# Altium schematic sheet Sensor_Box_Smart_IO.SchDoc: Title
size 420 x 297 mm; Author: G.Kasprowicz; CompanyName: WUT ISE; DrawnBy: G.Kasprowicz; Organization: WUT ISE; Address1: PW ISE; Address2: Nowowiejska 15/19 00-665 Warsaw; Address3: gkasprow@gmail.com; Revision: 1.0; SheetNumber: -; SheetTotal: -; ModifiedBy: -; CheckedDate: -; Title2: Title2; DivGrp: WUT ISE; Designer: G.Kasprowicz; ModifiedDate: -; ProjectName: Sensor Box
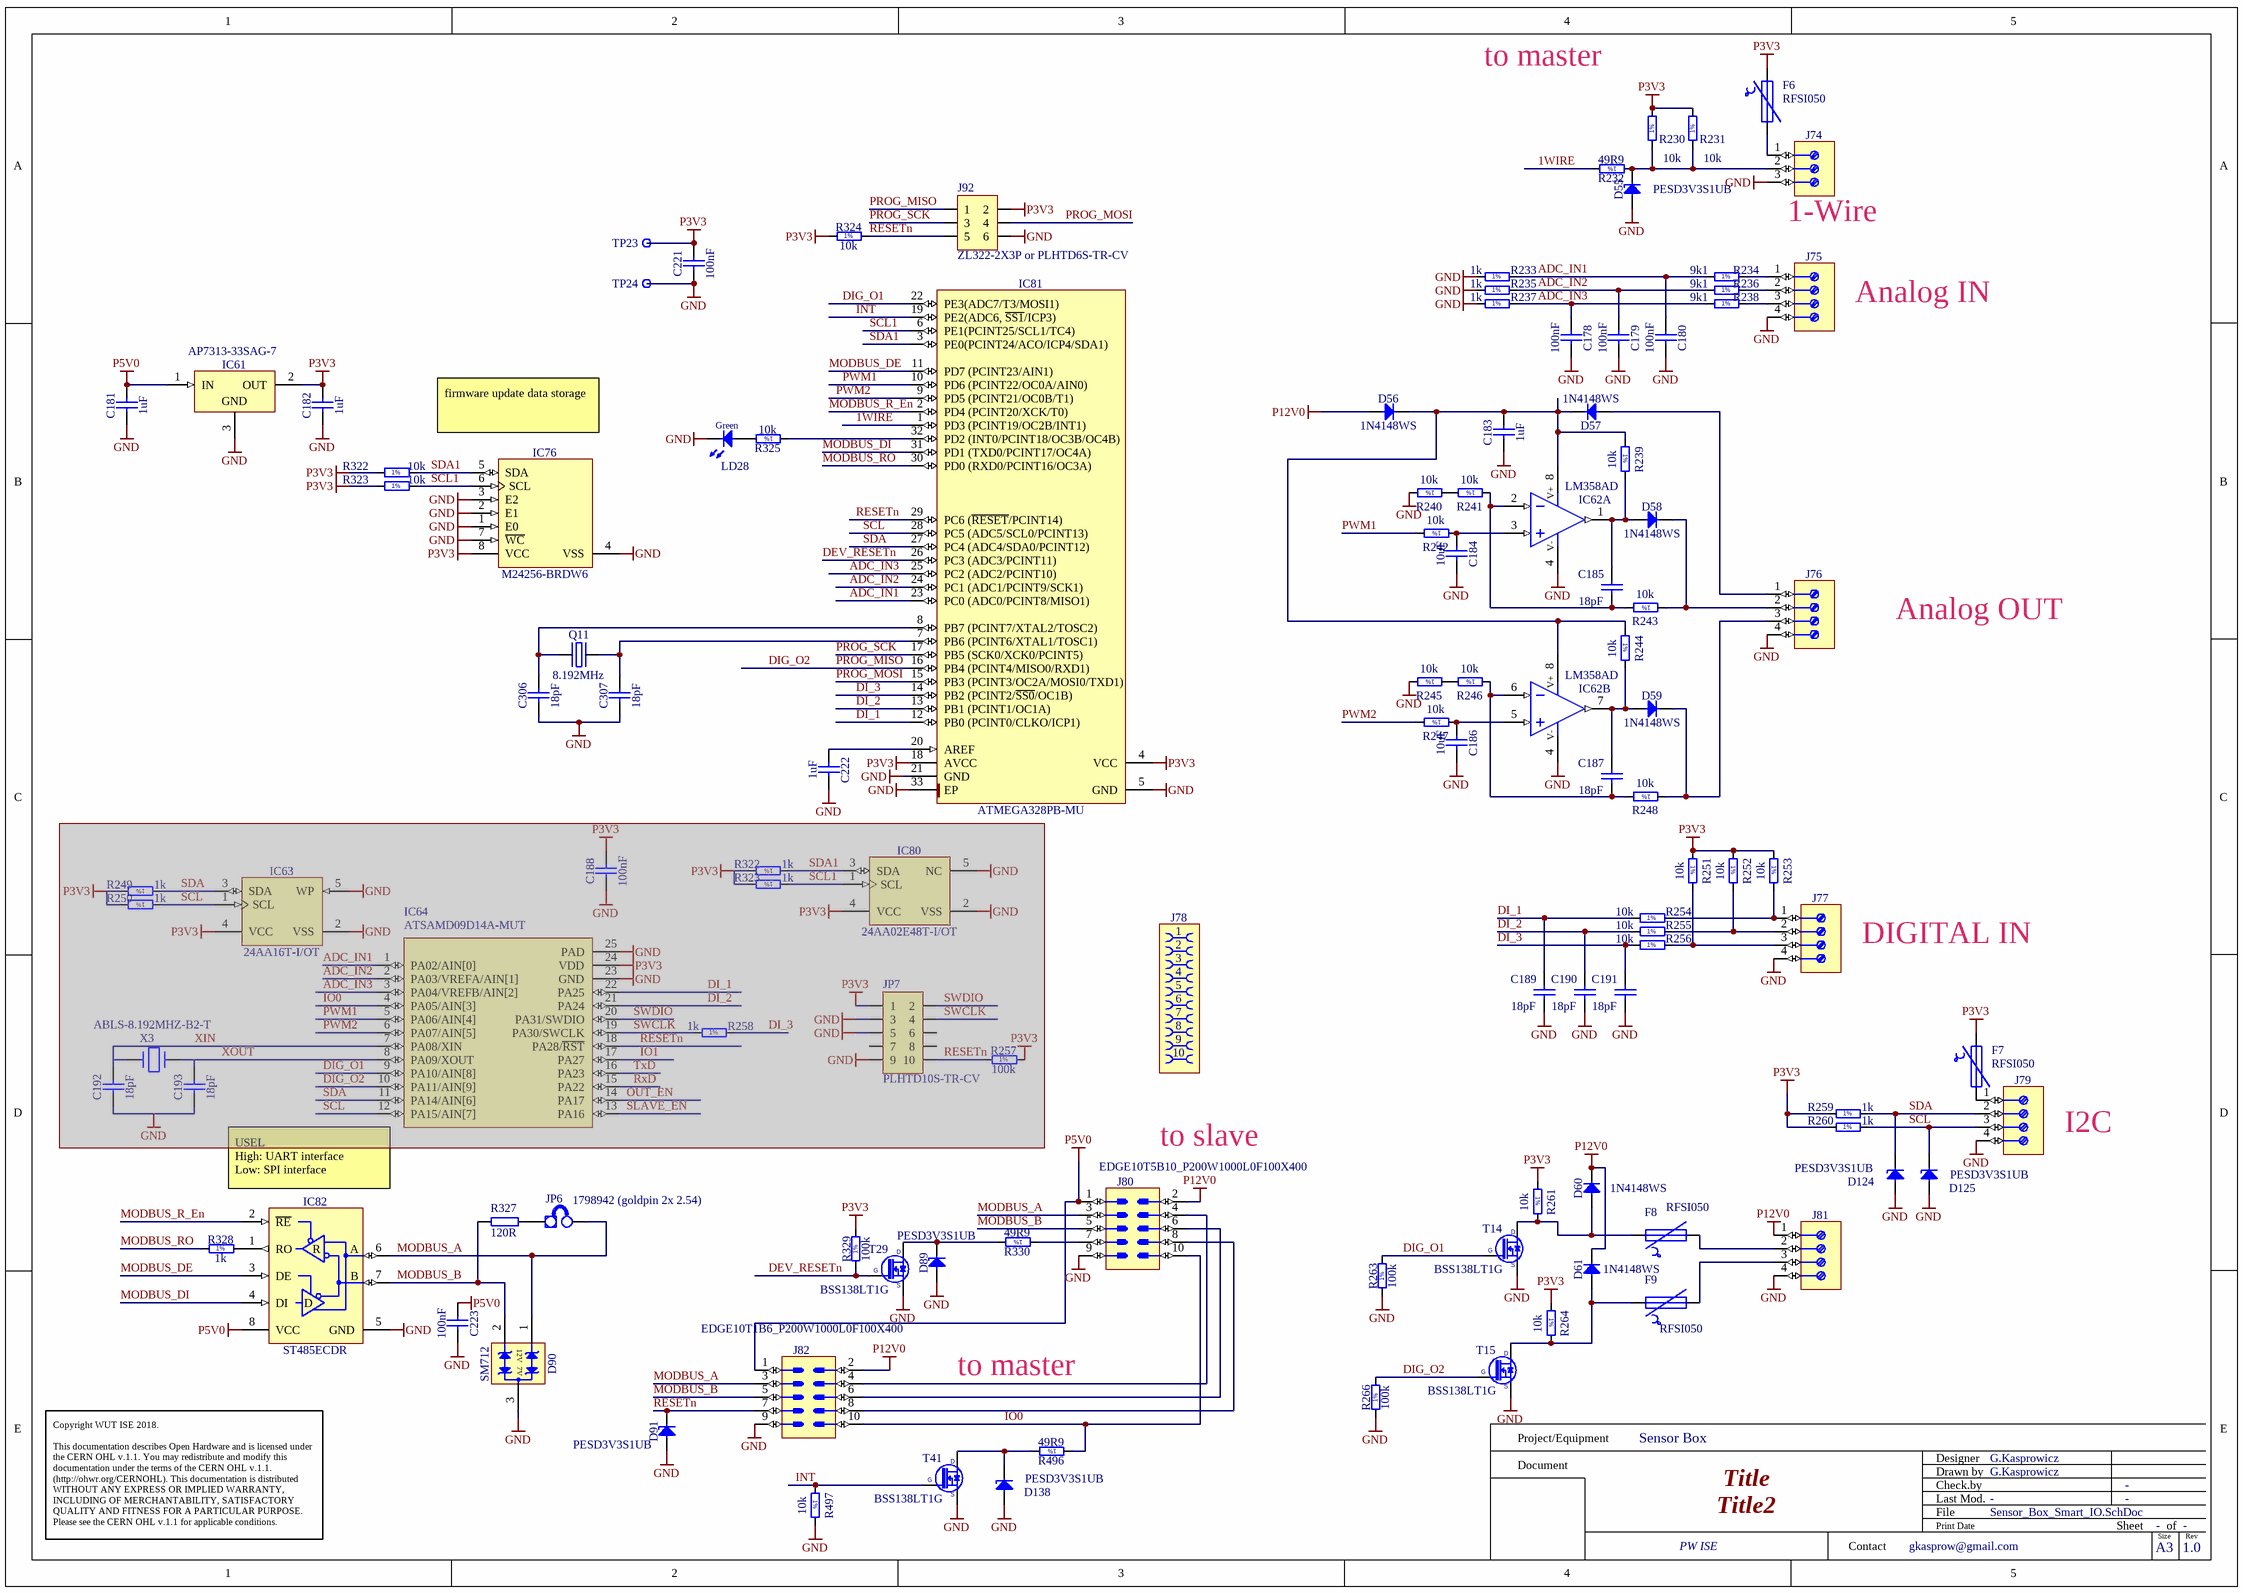
[diagram p0: Sensor_Box_Smart_IO.SchDoc]

## Parts
(Parts that share a designator on the sheet are numbered #1, #2 ... from top to bottom, then left to right.)
C178  100nF  [CAPC1005X55N]
C179  100nF  [CAPC1005X55N]
C180  100nF  [CAPC1005X55N]
C181  1uF  [CAPC1005X55N]
C182  1uF  [CAPC1005X55N]
C183  1uF  [CAPC1005X55N]
C184  10uF  [CAPC2012X135N]
C185  18pF  [CAPC1005X55N]
C186  10uF  [CAPC2012X135N]
C187  18pF  [CAPC1005X55N]
C188  100nF  [CAPC1005X55N]  (masked out: inside a compile mask, not in the netlist)
C189  18pF  [CAPC1005X55N]
C190  18pF  [CAPC1005X55N]
C191  18pF  [CAPC1005X55N]
C192  18pF  [CAPC1005X55N]  (masked out: inside a compile mask, not in the netlist)
C193  18pF  [CAPC1005X55N]  (masked out: inside a compile mask, not in the netlist)
C221  100nF  [CAPC1005X55N]
C222  1uF  [CAPC1005X55N]
C223  100nF  [CAPC1005X55N]
C306  18pF  [CAPC1005X55N]
C307  18pF  [CAPC1005X55N]
D55  PESD3V3S1UB  [SODFL1608X65N]
D56  1N4148WS  [SODFL2512X100N]
D57  1N4148WS  [SODFL2512X100N]
D58  1N4148WS  [SODFL2512X100N]
D59  1N4148WS  [SODFL2512X100N]
D60  1N4148WS  [SODFL2512X100N]
D61  1N4148WS  [SODFL2512X100N]
D89  PESD3V3S1UB  [SODFL1608X65N]
D90  SM712  [SOT95P237X112-3N]
D91  PESD3V3S1UB  [SODFL1608X65N]
D124  PESD3V3S1UB  [SODFL1608X65N]
D125  PESD3V3S1UB  [SODFL1608X65N]
D138  PESD3V3S1UB  [SODFL1608X65N]
F6  RFSI050  [0805R]
F7  RFSI050  [0805R]
F8  RFSI050  [0805R]
F9  RFSI050  [0805R]
IC61  AP7313-33SAG-7  [SOT95P240X130-3N]
IC62  LM358AD  [SOIC127P600X175-8N]  (parts A,B of 2)
IC63  24AA16T-I/OT  [SOT95P280X145-5N]  (masked out: inside a compile mask, not in the netlist)
IC64  ATSAMD09D14A-MUT  [QFN50P400X400X80_HS-25N]  (masked out: inside a compile mask, not in the netlist)
IC76  M24256-BRDW6  [SOP65P640X120-8N]
IC80  24AA02E48T-I/OT  [SOT95P280X145-5N]  (masked out: inside a compile mask, not in the netlist)
IC81  ATMEGA328PB-MU  [QFN50P500X500X100-33N-S325]
IC82  ST485ECDR  [SOIC127P600X175-8N]
J74  (no value)  [PHOENIX_1725669]
J75  (no value)  [PHOENIX_1725672]
J76  (no value)  [PHOENIX_1725672]
J77  (no value)  [PHOENIX_1725672]
J78  (no value)  [AVX_00 9159 010 061 916]
J79  (no value)  [PHOENIX_1725672]
J80  (no value)  [EDGE10T5B10_P200W1000L0F100X400]
J81  (no value)  [PHOENIX_1725672]
J82  (no value)  [EDGE10T1B6_P200W1000L0F100X400]
J92  ZL322-2X3P or PLHTD6S-TR-CV  [ZL322-2X3P]
JP6  1798942 (goldpin 2x 2.54)  [jump]
JP7  PLHTD10S-TR-CV  [PLHTD10S-TR-CV]  (masked out: inside a compile mask, not in the netlist)
LD28  Green  [LED_KINGBRIGHT_KPH-1608CGCK]
Q11  8.192MHz  [XTAL_ABRACON_ABLS]
R230  10k  [RESC1005X40N]
R231  10k  [RESC1005X40N]
R232  49R9  [RESC1005X40N]
R233  1k  [RESC1005X40N]
R234  9k1  [RESC1608X55N]
R235  1k  [RESC1005X40N]
R236  9k1  [RESC1608X55N]
R237  1k  [RESC1005X40N]
R238  9k1  [RESC1608X55N]
R239  10k  [RESC1005X40N]
R240  10k  [RESC1005X40N]
R241  10k  [RESC1005X40N]
R242  10k  [RESC1005X40N]
R243  10k  [RESC1005X40N]
R244  10k  [RESC1005X40N]
R245  10k  [RESC1005X40N]
R246  10k  [RESC1005X40N]
R247  10k  [RESC1005X40N]
R248  10k  [RESC1005X40N]
R249  1k  [RESC1005X40N]  (masked out: inside a compile mask, not in the netlist)
R250  1k  [RESC1005X40N]  (masked out: inside a compile mask, not in the netlist)
R251  10k  [RESC1005X40N]
R252  10k  [RESC1005X40N]
R253  10k  [RESC1005X40N]
R254  10k  [RESC1005X40N]
R255  10k  [RESC1005X40N]
R256  10k  [RESC1005X40N]
R257  100k  [RESC1005X40N]  (masked out: inside a compile mask, not in the netlist)
R258  1k  [RESC1005X40N]  (masked out: inside a compile mask, not in the netlist)
R259  1k  [RESC1005X40N]
R260  1k  [RESC1005X40N]
R261  10k  [RESC1005X40N]
R263  100k  [RESC1005X40N]
R264  10k  [RESC1005X40N]
R266  100k  [RESC1005X40N]
R322#1  10k  [RESC1005X40N]
R322#2  1k  [RESC1005X40N]  (masked out: inside a compile mask, not in the netlist)
R323#1  10k  [RESC1005X40N]
R323#2  1k  [RESC1005X40N]  (masked out: inside a compile mask, not in the netlist)
R324  10k  [RESC1005X40N]
R325  10k  [RESC1005X40N]
R327  120R  [1206R]
R328  1k  [RESC1005X40N]
R329  100k  [RESC1005X40N]
R330  49R9  [RESC1005X40N]
R496  49R9  [RESC1005X40N]
R497  10k  [RESC1005X40N]
T14  BSS138LT1G  [SOT95P240X110-3N]
T15  BSS138LT1G  [SOT95P240X110-3N]
T29  BSS138LT1G  [SOT95P240X110-3N]
T41  BSS138LT1G  [SOT95P240X110-3N]
TP23  Test Point  [TPS127]  (value not drawn)
TP24  Test Point  [TPS127]  (value not drawn)
X3  ABLS-8.192MHZ-B2-T  [HC-49SM]  (masked out: inside a compile mask, not in the netlist)

## Nets
GND: C178.2 C179.2 C180.2 C181.1 C182.1 C183.1 C184.2 C186.2 C189.2 C190.2 C191.2 C221.1 C222.2 C223.2 C306.1 C307.1 D55.2(A) D89.2(A) D90.3(GND) D91.2(A) D124.2(A) D125.2(A) D138.2(A) IC61.3(GND) IC62.4(V-) IC76.1(E0) IC76.2(E1) IC76.3(E2) IC76.4(VSS) IC76.7(~{WC}) IC81.5(GND) IC81.21(GND) IC81.33(EP) IC82.5(GND) J74.3 J75.4 J76.4 J77.4 J79.4 J80.9 J81.4 J82.9 J92.6 LD28.1(C) R233.1 R235.1 R237.1 R240.2 R245.2 R263.1 R266.1 R497.2 T14.2(S) T15.2(S) T29.2(S) T41.2(S) TP24.1
P3V3: C182.2 C221.2 F6.2 F7.2 IC61.2(OUT) IC76.8(VCC) IC81.4(VCC) IC81.18(AVCC) J92.2 R230.2 R231.2 R251.1 R252.1 R253.1 R259.1 R260.1 R261.1 R264.1 R322#1.1 R323#1.1 R324.1 R329.2 TP23.1
P5V0: C181.2 C223.1 IC61.1(IN) IC82.8(VCC) J80.1 J82.1
P12V0: D56.2(A) D60.1(C) D61.1(C) J80.2 J81.1 J82.2
1WIRE: IC81.1(PD3_(PCINT19/OC2B/INT1)) R232.2
ADC_IN1: C180.1 IC81.23(PC0_(ADC0/PCINT8/MISO1)) R233.2 R234.1
ADC_IN2: C179.1 IC81.24(PC1_(ADC1/PCINT9/SCK1)) R235.2 R236.1
ADC_IN3: C178.1 IC81.25(PC2_(ADC2/PCINT10)) R237.2 R238.1
DEV_RESETn: IC81.26(PC3_(ADC3/PCINT11)) R329.1 T29.1(G)
DI_1: C189.1 IC81.12(PB0_(PCINT0/CLKO/ICP1)) R254.1
DI_2: C190.1 IC81.13(PB1_(PCINT1/OC1A)) R255.1
DI_3: C191.1 IC81.14(PB2_(PCINT2/~{SS0}/OC1B)) R256.1
DIG_O1: IC81.22(PE3(ADC7/T3/MOSI1)) R263.2 T14.1(G)
DIG_O2: IC81.16(PB4_(PCINT4/MISO0/RXD1)) J92.1 R266.2 T15.1(G)  [also labelled PROG_MISO]
INT: IC81.19(PE2(ADC6,_~{SS1}/ICP3)) R497.1 T41.1(G)
IO0: J80.10 J82.10 R496.1
MODBUS_A: D90.1(I/O1) IC82.6(A) J80.3 J82.3 JP6.2(E2)
MODBUS_B: D90.2(I/O2) IC82.7(B) J80.5 J82.5 R327.1
MODBUS_DE: IC81.11(PD7_(PCINT23/AIN1)) IC82.3(DE)
MODBUS_DI: IC81.31(PD1_(TXD0/PCINT17/OC4A)) IC82.4(DI)
MODBUS_R_En: IC81.2(PD4_(PCINT20/XCK/T0)) IC82.2(~{RE})
MODBUS_RO: IC81.30(PD0_(RXD0/PCINT16/OC3A)) R328.1
PROG_MOSI: IC81.15(PB3_(PCINT3/OC2A/MOSI0/TXD1)) J92.4
PROG_SCK: IC81.17(PB5_(SCK0/XCK0/PCINT5)) J92.3
PWM1: IC81.10(PD6_(PCINT22/OC0A/AIN0)) R242.2
PWM2: IC81.9(PD5_(PCINT21/OC0B/T1)) R247.2
RESETn: D91.1(C) IC81.29(PC6_(~{RESET}/PCINT14)) J82.7 J92.5 R324.2
SCL: D125.1(C) IC81.28(PC5_(ADC5/SCL0/PCINT13)) J79.3 R260.2
SCL1: IC76.6(SCL) IC81.6(PE1(PCINT25/SCL1/TC4)) R323#1.2
SDA: D124.1(C) IC81.27(PC4_(ADC4/SDA0/PCINT12)) J79.2 R259.2
SDA1: IC76.5(SDA) IC81.3(PE0(PCINT24/ACO/ICP4/SDA1)) R322#1.2
NetC183_2: C183.2 D56.1(C) D57.1(C) IC62.8(V+) R239.1 R244.1
NetC184_1: C184.1 IC62.3(IN+) R242.1
NetC185_1: C185.1 D58.2(A) IC62.1(OUT) R239.2
NetC185_2: C185.2 IC62.2(IN-) R241.1 R243.2
NetC186_1: C186.1 IC62.5(IN+) R247.1
NetC187_1: C187.1 D59.2(A) IC62.7(OUT) R244.2
NetC187_2: C187.2 IC62.6(IN-) R246.1 R248.2
NetC222_1: C222.1 IC81.20(AREF)
NetC306_2: C306.2 IC81.8(PB7_(PCINT7/XTAL2/TOSC2)) Q11.1(OSC1)
NetC307_2: C307.2 IC81.7(PB6_(PCINT6/XTAL1/TOSC1)) Q11.2(OSC2)
NetD55_1: D55.1(C) J74.2 R230.1 R231.1 R232.1
NetD57_2: D57.2(A) J76.1
NetD58_1: D58.1(C) J76.2 R243.1
NetD59_1: D59.1(C) J76.3 R248.1
NetD60_2: D60.2(A) F8.2 R261.2 T14.3(D)
NetD61_2: D61.2(A) F9.2 R264.2 T15.3(D)
NetD89_1: D89.1(C) R330.2 T29.3(D)
NetD138_1: D138.1(C) R496.2 T41.3(D)
NetF6_1: F6.1 J74.1
NetF7_1: F7.1 J79.1
NetF8_1: F8.1 J81.2
NetF9_1: F9.1 J81.3
NetIC81_32: IC81.32(PD2_(INT0/PCINT18/OC3B/OC4B)) R325.1
NetIC82_1: IC82.1(RO) R328.2
NetJ75_1: J75.1 R234.2
NetJ75_2: J75.2 R236.2
NetJ75_3: J75.3 R238.2
NetJ77_1: J77.1 R253.2 R254.2
NetJ77_2: J77.2 R252.2 R255.2
NetJ77_3: J77.3 R251.2 R256.2
NetJ80_4: J80.4 J82.4
NetJ80_6: J80.6 J82.6
NetJ80_7: J80.7 R330.1
NetJ80_8: J80.8 J82.8
NetJP6_1: JP6.1(E1) R327.2
NetLD28_2: LD28.2(A) R325.2
NetR240_1: R240.1 R241.2
NetR245_1: R245.1 R246.2

## Notes on the sheet
- (near R230) to master
- (near J74) 1-Wire
- Analog IN
- firmware update data storage
- Analog OUT
- DIGITAL IN
- I2C
- (near IC64) USEL
  High: UART interface
  Low: SPI interface
- (near J80) to slave
- to master
- Project/Equipment
- Document
- Designer
- Drawn by
- Check.by
- Copyright WUT ISE 2018.
  This documentation describes Open Hardware and is licensed under the CERN OHL v.1.1. You may redistribute and modify this documentation under the terms of the CERN OHL v.1.1. (http://ohwr.org/CERNOHL). This documentation is distributed WITHOUT ANY EXPRESS OR IMPLIED WARRANTY, INCLUDING OF MERCHANTABILITY, SATISFACTORY QUALITY AND FITNESS FOR A PARTICULAR PURPOSE. Please see the CERN OHL v.1.1 for applicable conditions.
- Contact
- File
- Last Mod.
- Print Date
- Sheet
- Size
- A3
- of
- Rev
- (in symbol R0402_1K_1%_0.0625W_100PPM) 1%
- (in symbol R0402_10K_1%_0.0625W_100PPM) 1%
- (in symbol R0402_49R9_1%_0.0625W_100PPM) 1%
- (in symbol R0402_100K_1%_0.0625W_100PPM) 1%
- (in symbol R0603_9K1_1%_0.1W_100PPM) 1%
- (in symbol SM712) 12V; 7V
- (in symbol ST485ECDR) R; D

## Library data of the parts
C178-C180 C223 = CC0402_100NF_16V_10%_X7R: Non-polarised capacitor; Part Description: SMD Multilayer Chip Ceramic Capacitor; Manufacturer: GENERIC; Manufacturer1 Part Number: GRM155R71C104KA88D; Voltage: 16V; TC: X7R; Tolerance: ±10%; Part Number: CC0402_100NF_16V_10%_X7R; Component Kind: Standard; Component Type: Standard; Pin Count: 2; Value: 100nF; Status: Not Recommended; Manufacturer Part Number: CC0402_100NF_16V_10%_X7R; Case: 0402; Mounted: Yes; Socket: No; SMD: Yes; Manufacturer1 Example: MURATA; Manufacturer1 ComponentHeight: 0.55mm; HelpURL: \\cern.ch\dfs\Applications\Altium\Datasheets\CC0402_X7R_MURATA_GRM.pdf; Author: CERN DEM JLC; CreateDate: 05.12.2013; LatestRevisionDate: 03.12.2007; Sense: No
C181-C183 C222 = CC0402_1UF_16V_10%_X5R: Non-polarised capacitor; Part Description: SMD Multilayer Chip Ceramic Capacitor; Manufacturer: GENERIC; Manufacturer1 Part Number: C1005X5R1C105KT; Voltage: 16V; TC: X5R; Tolerance: ±10%; Part Number: CC0402_1UF_16V_10%_X5R; Component Kind: Standard; Component Type: Standard; Pin Count: 2; Value: 1uF; Status: Preferred; Manufacturer Part Number: CC0402_1UF_16V_10%_X5R; Case: 0402; Mounted: Yes; Socket: No; SMD: Yes; Sense: No; Manufacturer1 Example: TDK; Manufacturer1 ComponentHeight: 0.55mm; HelpURL: \\cern.ch\dfs\Applications\Altium\Datasheets\CC0402_X5R_TDK_C.pdf; Author: CERN DEM JLC; CreateDate: 25.10.2012; LatestRevisionDate: 25.10.2012
C184 C186 = CC0805_10UF_16V_10%_X5R: Non-polarised capacitor; Part Description: SMD Multilayer Chip Ceramic Capacitor; Manufacturer: GENERIC; Manufacturer1 Part Number: C0805C106K4PAC; Voltage: 16V; TC: X5R; Tolerance: ±10%; Part Number: CC0805_10UF_16V_10%_X5R; Component Kind: Standard; Component Type: Standard; Pin Count: 2; Value: 10uF; Status: Preferred; Manufacturer Part Number: CC0805_10UF_16V_10%_X5R; Case: 0805; Mounted: Yes; Socket: No; SMD: Yes; Manufacturer1 Example: KEMET; Manufacturer1 ComponentHeight: 1.4mm; HelpURL: \\cern.ch\dfs\Applications\Altium\Datasheets\CC1206_X5R_KEMET.pdf; Author: CERN DEM JLC; CreateDate: 03.12.2007; LatestRevisionDate: 03.12.2007; Sense: No
C185 C187 C189-C193 C306 C307 = CC0402_18PF_50V_5%_C0G: Non-polarised capacitor; Part Description: SMD Multilayer Chip Ceramic Capacitor; Manufacturer: GENERIC; Manufacturer1 Part Number: C0402C180J5GACTU; Voltage: 50V; TC: C0G/NP0; Tolerance: ±5%; Part Number: CC0402_18PF_50V_5%_C0G; Component Kind: Standard; Component Type: Standard; Pin Count: 2; Value: 18pF; Status: Preferred; Manufacturer Part Number: CC0402_18PF_50V_5%_C0G; Case: 0402; Mounted: Yes; Socket: No; SMD: Yes; Sense: No; Manufacturer1 Example: KEMET; Manufacturer1 ComponentHeight: 0.55mm; HelpURL: \\cern.ch\dfs\Applications\Altium\Datasheets\CC0805_C0G_KEMET_(Commercial Grade).pdf; Author: CERN DEM JLC; CreateDate: 04.10.2016; LatestRevisionDate: 04.10.2016
C188 C221 = CC0402_100NF_16V_10%_X5R: Non-polarised capacitor; Part Description: SMD Multilayer Chip Ceramic Capacitor; Manufacturer: GENERIC; Manufacturer1 Part Number: GRM155R61C104KA88D; Voltage: 16V; TC: X5R; Tolerance: ±10%; Part Number: CC0402_100NF_16V_10%_X5R; Component Kind: Standard; Component Type: Standard; Pin Count: 2; Value: 100nF; Status: None; Manufacturer Part Number: CC0402_100NF_16V_10%_X5R; Case: 0402; Mounted: Yes; Socket: No; SMD: Yes; Sense: No; Manufacturer1 Example: MURATA; Manufacturer1 ComponentHeight: 0.55mm; HelpURL: \\cern.ch\dfs\Applications\Altium\Datasheets\CC0402_X5R_MURATA_GRM.pdf; Author: CERN DEM JLC; CreateDate: 10.12.2013; LatestRevisionDate: 10.12.2013
D55 D89 D91 D124 D125 D138 = PESD3V3S1UB: ESD protection diode; Part Description: ESD protection diode (23kV); Manufacturer: NXP SEMICONDUCTORS; Voltage: 3V3; Power: 330W; PressFit: No; Bonding: No; Part Number: PESD3V3S1UB; Component Kind: Standard; Component Type: Standard; Device: PESD3V3S1UB; PackageDescription: Ultra Small Outline Diode Flat Lead (SOD-523), Body; 1.2mm L X 0.8mm W X 0.65mm H, IPC Medium Density; Manufacturer Part Number: PESD3V3S1UB; Pin Count: 2; Case: SOD523; Mounted: Yes; Socket: No; SMD: Yes; Sense: No; ComponentHeight: 0.65mm; HelpURL: \\cern.ch\dfs\Applications\Altium\Datasheets\PESD3V3S1UB.pdf; Author: CERN DEM JLC; CreateDate: 29.11.2012; LatestRevisionDate: 29.11.2012
D56-D61 = 1N4148WS: Diode; Part Description: Small Signal Diodes; Manufacturer: FAIRCHILD SEMICONDUCTOR; Voltage: 75V; Power: 150mA; PressFit: No; Bonding: No; Part Number: 1N4148WS; Component Kind: Standard; Component Type: Standard; Device: 1N4148WS; PackageDescription: SODFL Diode; 1.70mm W X 1.25mm L X 1.00mm H body, IPC Medium Density; Manufacturer Part Number: 1N4148WS; Pin Count: 2; Case: SOD-323F; Mounted: Yes; Socket: No; SMD: Yes; Sense: No; ComponentHeight: 1mm; HelpURL: \\cern.ch\dfs\Applications\Altium\Datasheets\1N4148WS.pdf; Author: CERN DEM JLC; CreateDate: 12.05.2011; LatestRevisionDate: 12.05.2011
D90 = SM712: Asymmetrical TVS Diode for Extended Common-Mode RS-485; Manufacturer: SEMTECH; Voltage: 12V/-7V; Power: 400W; PressFit: No; Bonding: No; Part Number: SM712; Component Kind: Standard; Component Type: Standard; Device: SM712; PackageDescription: SOT, 0.95mm, pitch; 3 pin,1.30mm W X 2.92mm L X 1.12mm H body, IPC Medium Density; Status: Obsolete; Part Description: Asymmetrical TVS Diode for Extended Common-Mode RS-485; Manufacturer Part Number: SM712; Pin Count: 3; Case: SOT-23; Mounted: Yes; Socket: No; SMD: Yes; Sense: No; ComponentHeight: 1.12mm; HelpURL: \\cern.ch\dfs\Applications\Altium\Datasheets\SM712.pdf; Author: CERN DEM JLC; CreateDate: 23.04.2012; LatestRevisionDate: 23.04.2012
F6-F9 = F_PTC_0.05A: 50mA polymer FUSE
IC61 = AP7313-33SAG-7: 3-Terminal Regulator 1=IN 2=OUT 3=GND; Part Description: 3.3V, 150mA Low Quiescent Current, Fast Transient Low Dropout Linear Regulator; Manufacturer: DIODES INCORPORATED; PressFit: No; Bonding: No; Part Number: AP7313-33SAG-7; Component Kind: Standard; Component Type: Standard; Device: AP7313-33SAG-7; PackageDescription: SOT23 3-Leads, Pitch 0.95mm - Body 1.3x2.9mm, IPC Medium Density; Manufacturer Part Number: AP7313-33SAG-7; Pin Count: 3; Case: SOT23; Mounted: Yes; Socket: No; SMD: Yes; Sense: No; ComponentHeight: 1.35mm; HelpURL: \\cern.ch\dfs\Applications\Altium\Datasheets\AP7313-33SAG-7.pdf; Author: CERN DEM JLC; CreateDate: 20.03.2018; LatestRevisionDate: 20.03.2018
IC62 = LM358AD: Dual Operational Amplifier; Manufacturer: TEXAS INSTRUMENTS; PressFit: No; Bonding: No; Part Number: LM358AD; Component Kind: Standard; Component Type: Standard; Device: LM358AD; PackageDescription: SOIC 8, Pitch 1.27mm - Body 4x5mm, IPC Medium Density; Part Description: Dual Operational Amplifier; Manufacturer Part Number: LM358AD; Pin Count: 8; Case: SOIC8; Mounted: Yes; Socket: No; SMD: Yes; Sense: No; ComponentHeight: 1.75mm; Author: CERN DEM JLC; HelpURL: \\cern.ch\dfs\Applications\Altium\Datasheets\LM358AD.pdf; CreateDate: 02.12.2008; LatestRevisionDate: 13.04.2010
IC63 = MEM_24AA16T_SOT23: 1.7V-5.5V, 2K I2C Serial EEPROM With EUI-48 Node Identity; Part Description: 1.7V-5.5V, 16K I2C Serial EEPROM; Manufacturer: MICROCHIP TECHNOLOGY; PressFit: No; Bonding: No; Part Number: 24AA16T-I/OT; Component Kind: Standard; Component Type: Standard; Device: 24AA16T-I/OT; PackageDescription: SOT, 0.95mm pitch; 5 pin, 1.60mm W X 2.90mm L X 1.45mm H body, IPC Medium Density; Manufacturer Part Number: 24AA16T-I/OT; Pin Count: 5; Case: SOT23-5; Mounted: Yes; Socket: No; SMD: Yes; Sense: No; ComponentHeight: 1.45mm; HelpURL: \\cern.ch\dfs\Applications\Altium\Datasheets\24AA02E48T-I-OT.pdf; Author: GK; CreateDate: 31.03.2016; LatestRevisionDate: 31.03.2016
IC64 = UPC_ATSAMD09D: 32-bit ARM®-based Cortex®-M4 core Microcontroller, 1.62V to 3.6V, 120MHz, 256KB Flash, 64KB of SRAM, 48 QFP, Industrial Grade (-40°C to 85°C); Part Description: ATSAMD09D14A-MUT  SMART SAMD09, SMART ARM based Microcontrollers, 32 bity, 48 MHz, 16 KB, 4 KB; Manufacturer: Microchip; PressFit: No; Bonding: No; Part Number: ATSAMD09D14A-MUT; Component Kind: Standard; Component Type: Standard; Device: ATSAMD09D14A-MUT; PackageDescription: QFN, 24-Leads, Body 4.00x4.00mm, Pitch 0.50mm, Thermal Pad 2.60x2.60mm, IPC Medium Density; Manufacturer Part Number: ATSAMD09D14A-MUT; Pin Count: 24; Case: QFN24; Mounted: Yes; Socket: No; SMD: Yes; Sense: No; ComponentHeight: 1.6mm; HelpURL: \\cern.ch\dfs\Applications\Altium\Datasheets\ATSAM4S4AA-AU.pdf; Author: GK; CreateDate: 16.12.2017; LatestRevisionDate: 16.12.2017
IC76 = MEM_M24256-BRDW6P: 256-Kbit Serial I²C Bus EEPROM; Manufacturer: ST MICROELECTRONICS; PressFit: No; Bonding: No; Part Number: M24256-BRDW6P; Component Kind: Standard; Component Type: Standard; Device: M24256-BRDW6; PackageDescription: SOP, 0.65mm pitch; 8 pin, 4.40mm W X 3.00mm L X 1.20mm H body, IPC Medium Density; Part Description: 256-Kbit Serial I²C Bus EEPROM; Manufacturer Part Number: M24256-BRDW6; Pin Count: 8; Case: TSSOP8; Mounted: Yes; Socket: No; SMD: Yes; Sense: No; ComponentHeight: 1.2mm; HelpURL: \\cern.ch\dfs\Applications\Altium\Datasheets\M24256-BRDW6P.pdf; Author: CERN DEM MR; CreateDate: 17.03.2016; LatestRevisionDate: 17.03.2016
IC80 = 24AA02E48T-I/OT: 1.7V-5.5V, 2K I2C Serial EEPROM With EUI-48 Node Identity; Manufacturer: MICROCHIP TECHNOLOGY; PressFit: No; Bonding: No; Part Number: 24AA02E48T-I/OT; Component Kind: Standard; Component Type: Standard; Device: 24AA02E48T-I/OT; PackageDescription: SOT, 0.95mm pitch; 5 pin, 1.60mm W X 2.90mm L X 1.45mm H body, IPC Medium Density; Part Description: 1.7V-5.5V, 2K I2C Serial EEPROM With EUI-48 Node Identity; Manufacturer Part Number: 24AA02E48T-I/OT; Pin Count: 5; Case: SOT23-5; Mounted: Yes; Socket: No; SMD: Yes; Sense: No; ComponentHeight: 1.45mm; HelpURL: \\cern.ch\dfs\Applications\Altium\Datasheets\24AA02E48T-I-OT.pdf; Author: CERN DEM MR; CreateDate: 31.03.2016; LatestRevisionDate: 31.03.2016
IC81 = UPC_ATMEGA328PB-MU: 8-bit AVR 20MHz Microcontroller With 32K Bytes In-System  Programmable  Flash; Part Description: 8-bit AVR Microcontroller, 32KB Flash, 1KB EEPROM, 2KB SRAM, 32-pin MLF, Industrial Grade (-40°C to 85°C); Manufacturer: ATMEL; PressFit: No; Bonding: No; Part Number: ATMEGA328PB-MU; Component Kind: Standard; Component Type: Standard; Device: ATMEGA328PB-MU; PackageDescription: QFN, (MO-220-VHHD-2) 0.50mm pitch,square; 8 pin X 8 pin, 5mm X 5mm X 1.00mm H body (w/thermal tab 3.25 X 3.25mm),  IPC Medium Density; Manufacturer Part Number: ATMEGA328PB-MU; Pin Count: 33; Case: QFN32; Mounted: Yes; Socket: No; SMD: Yes; Sense: No; ComponentHeight: 1mm; HelpURL: \\cern.ch\dfs\Applications\Altium\Datasheets\ATMEGA328P-MU.pdf; Author: GK; CreateDate: 2011-02-08; LatestRevisionDate: 2014-07-02
IC82 = ST485ECDR: ±15kV ESD-Protected, Low Power  RS-485/RS-422 Transceiver; Manufacturer: ST MICROELECTRONICS; PressFit: No; Bonding: No; Part Number: ST485ECDR; Component Kind: Standard; Component Type: Standard; Device: ST485ECDR; PackageDescription: SOIC 8, Pitch 1.27mm - Body 4x5mm, IPC Medium Density; Part Description: ±15kV ESD-Protected, Low Power  RS-485/RS-422 Transceiver; Manufacturer Part Number: ST485ECDR; Pin Count: 8; Case: SOIC8; Mounted: Yes; Socket: No; SMD: Yes; Sense: No; ComponentHeight: 1.75mm; Author: CERN DEM MR; HelpURL: \\cern.ch\dfs\Applications\Altium\Datasheets\ST485ECDR.pdf; CreateDate: 15.02.2018; LatestRevisionDate: 15.02.2018
J74 = PHOENIX_1725669: Terminal Block, 3 Positions, Screw Connection; Part Description: 6A, 63V, Terminal Block, Pitch 2.54mm, 3 Positions, Screw Connection; Manufacturer: PHOENIX CONTACT; Manufacturer Part Number: 1725669 (MPT 0,5/3-2,54); PressFit: No; Part Number: PHOENIX_1725669; Component Kind: Standard; Component Type: Standard; Pin Count: 3; Mounted: Yes; Socket: No; SMD: No; Sense: No; Status: None; ComponentHeight: 8.5mm; HelpURL: \\cern.ch\dfs\Applications\Altium\Datasheets\PHOENIX_1725669.pdf; Author: CERN DEM JMW; CreateDate: 07.11.2008; LatestRevisionDate: 26.04.2010
J75-J77 J79 J81 = PHOENIX_1725672: Terminal Block, 4 Positions, Screw Connection; Part Description: 6A, 63V, Terminal Block, Pitch 2.54mm, 4 Positions, Screw Connection; Manufacturer: PHOENIX CONTACT; Manufacturer Part Number: 1725672 (MPT 0,5/4-2,54); PressFit: No; Part Number: PHOENIX_1725672; Component Kind: Standard; Component Type: Standard; Pin Count: 4; Mounted: Yes; Socket: No; SMD: No; Sense: No; Status: None; ComponentHeight: 8.5mm; HelpURL: \\cern.ch\dfs\Applications\Altium\Datasheets\PHOENIX_1725672.pdf; Author: CERN DEM JMW; CreateDate: 07.11.2008; LatestRevisionDate: 26.04.2010
J78 = AVX_00 9159 010 061 916: Open Ended Card Edge Connector, 9159 Series; Part Description: 10 Contacts, 2mm Pitch, Open Ended Card Edge Connector, 9159 Series; Manufacturer: AVX; PressFit: No; Part Number: AVX_00 9159 010 061 916; Component Kind: Standard; Component Type: Standard; Pin Count: 10; Mounted: Yes; Socket: No; SMD: No; Sense: No; Status: None; Manufacturer Part Number: 00 9159 010 061 916; ComponentHeight: 1.6mm; HelpURL: \\cern.ch\dfs\Applications\Altium\Datasheets\AVX_00 9159 010 061 916.pdf; Author: CERN DEM MR; CreateDate: 13.02.2018; LatestRevisionDate: 13.02.2018
J80 = EDGE10T5B10_P200W1000L0F100X400: PCB Edge Connector 10 (2x5); Part Description: 10 Contacts Board Edge Connector, Pitch 2mm, Length 0mm, Width 10mm, Finger Lenght 4mm, Finger Width 1mm; Mounted: No; PressFit: No; Part Number: EDGE10T5B10_P200W1000L0F100X400; Component Kind: Standard (No BOM); Component Type: Standard (No BOM); Pin Count: 10; Socket: No; SMD: No; Sense: No; Status: None; ComponentHeight: 0mm; HelpURL: \\cern.ch\dfs\Applications\Altium\Datasheets\EDGE10T5B10_P200W1000L0F100X400.pdf; Author: CERN DEM MR; CreateDate: 14.02.2018; LatestRevisionDate: 14.02.2018
J82 = EDGE10T1B6_P200W1000L0F100X400: PCB Edge Connector 10 (2x5); Part Description: 10 Contacts Board Edge Connector, Pitch 2mm, Length 0mm, Width 10mm, Finger Lenght 4mm, Finger Width 1mm; Mounted: No; PressFit: No; Part Number: EDGE10T1B6_P200W1000L0F100X400; Component Kind: Standard (No BOM); Component Type: Standard (No BOM); Pin Count: 10; Socket: No; SMD: No; Sense: No; Status: None; ComponentHeight: 0mm; HelpURL: \\cern.ch\dfs\Applications\Altium\Datasheets\EDGE10T1B6_P200W1000L0F100X400.pdf; Author: CERN DEM MR; CreateDate: 14.02.2018; LatestRevisionDate: 14.02.2018
J92 = CON_2x3 1.27 SMT Male: 1.27 mm dual row goldpin (Maritex)
JP6 = JUMPER: Supplier 1: Farnell; Supplier Part Number 1: 1798942
JP7 = CON_2x5 1.27 SMT Male: 1.27 mm dual row goldpin (Maritex)
LD28 = LED_KINGBRIGHT_KPH-1608CGCK: LED Green 1C 2A; Part Description: SMD Green LED, Case 1.6mmX0.8mm(0603), 0.65mm Thickness; PressFit: No; Bonding: No; Part Number: LED_KINGBRIGHT_KPH-1608CGCK; Component Kind: Standard; Component Type: Standard; Color: Green; PackageDescription: SMT Green LED, Case 0603, Body L 1.6 x W 0.8mm H 0.65mm; Manufacturer: KINGBRIGHT; Manufacturer Part Number: KPH-1608CGCK; Pin Count: 2; Mounted: Yes; Socket: No; SMD: Yes; Sense: No; ComponentHeight: 0.65mm; HelpURL: \\cern.ch\dfs\Applications\Altium\Datasheets\LED_KINGBRIGHT_KPH-1608CGCK.pdf; Author: CERN DEM JLC; CreateDate: 03.07.2017; LatestRevisionDate: 03.07.2017
Q11 = XTAL_8.192MHZ_ABRACON_ABLS-8.192MHZ-B2-T: Quartz Crystal; Part Description: Tolerance: ± 20ppm, Stability: ± 50ppm, -20°C to +70°C, 18pF, 80 Ohms ESR, Low Profile Surface Mount Microprocessor Crystal, ABLS Series; PressFit: No; Bonding: No; Part Number: XTAL_8.192MHZ_ABRACON_ABLS-8.192MHZ-B2-T; Component Kind: Standard; Component Type: Standard; PackageDescription: SMD Crystal, Body 11.40mm L X 4.70mm W X 4.20mm H, HC/49US (AT49) ALBS Series; Value: 8.192MHz; Manufacturer: ABRACON; Manufacturer Part Number: ABLS-8.192MHZ-B2-T; Pin Count: 2; Mounted: Yes; Socket: No; SMD: Yes; Sense: No; ComponentHeight: 4.2mm; HelpURL: \\cern.ch\dfs\Applications\Altium\Datasheets\XTAL_ABRACON_ABLS.pdf; Author: CERN DEM MR; CreateDate: 15.02.2018; LatestRevisionDate: 15.02.2018
R230 R231 R239-R248 R251-R256 R261 R264 R497 = R0402_10K_1%_0.0625W_100PPM: Resistor - 1%; Part Description: General Purpose Thick Film Chip Resistor; Manufacturer: GENERIC; Manufacturer1 Part Number: 232270671003L; TC: ±100ppm/°C; Table: Resistors SMD; Part Number: R0402_10K_1%_0.0625W_100PPM; Component Kind: Standard; Component Type: Standard; Pin Count: 2; Value: 10k; Status: Not recommended; Power: 0.0625W; Tolerance: ±1%; Manufacturer Part Number: R0402_10K_1%_0.0625W_100PPM; Case: 0402; Mounted: Yes; Socket: No; SMD: Yes; Manufacturer1 Example: YAGEO PHYCOMP; Manufacturer1 ComponentHeight: 0.4mm; HelpURL: \\cern.ch\dfs\Applications\Altium\Datasheets\R0402_Phycomp_RC0402.pdf; Author: CERN DEM JLC; CreateDate: 2007-12-03; LatestRevisionDate: 2012-10-17
R232 R330 R496 = R0402_49R9_1%_0.0625W_100PPM: Resistor - 1%; Part Description: General Purpose Thick Film Chip Resistor; Manufacturer: GENERIC; Manufacturer1 Part Number: 232270674999L or RC0402FR-0749R9L; TC: ±100ppm/°C; Table: Resistors SMD; Part Number: R0402_49R9_1%_0.0625W_100PPM; Component Kind: Standard; Component Type: Standard; Pin Count: 2; Value: 49R9; Status: Not recommended; Power: 0.0625W; Tolerance: ±1%; Manufacturer Part Number: R0402_49R9_1%_0.0625W_100PPM; Case: 0402; Mounted: Yes; Socket: No; SMD: Yes; Manufacturer1 Example: YAGEO PHYCOMP; Manufacturer1 ComponentHeight: 0.4mm; HelpURL: \\cern.ch\dfs\Applications\Altium\Datasheets\R0402_Phycomp_RC0402.pdf; Author: CERN DEM JLC; CreateDate: 2012-10-24; LatestRevisionDate: 2012-10-24
R233 R235 R237 R249 R250 R258-R260 R322#2 R323#2 R328 = R0402_1K_1%_0.0625W_100PPM: Resistor - 1%; Part Description: General Purpose Thick Film Chip Resistor; Manufacturer: GENERIC; Manufacturer1 Part Number: 232270671002L; TC: ±100ppm/°C; PressFit: No; Part Number: R0402_1K_1%_0.0625W_100PPM; Component Kind: Standard; Component Type: Standard; Pin Count: 2; Value: 1k; Status: Not Recommended; Power: 0.0625W; Tolerance: ±1%; Manufacturer Part Number: R0402_1K_1%_0.0625W_100PPM; Case: 0402; Mounted: Yes; Sense: No; Socket: No; SMD: Yes; Manufacturer1 Example: YAGEO PHYCOMP; Manufacturer1 ComponentHeight: 0.4mm; HelpURL: \\cern.ch\dfs\Applications\Altium\Datasheets\R0402_Phycomp_RC0402.pdf; Author: CERN DEM JLC; CreateDate: 03.12.2007; LatestRevisionDate: 17.10.2012
R234 R236 R238 = R0603_9K1_1%_0.1W_100PPM: Resistor - 1%; Part Description: General Purpose Thick Film Chip Resistor; Manufacturer: GENERIC; Manufacturer1 Part Number: NRC06F9101TRF; Power: 0.1W; TC: ±100ppm/°C; PressFit: No; Part Number: R0603_9K1_1%_0.1W_100PPM; Component Kind: Standard; Component Type: Standard; Pin Count: 2; Value: 9k1; Status: Preferred; Tolerance: ±1%; Manufacturer Part Number: R0603_9K1_1%_0.1W_100PPM; Case: 0603; Mounted: Yes; Sense: No; Socket: No; SMD: Yes; Manufacturer1 Example: NIC COMPONENT; Manufacturer1 ComponentHeight: 0.55mm; HelpURL: \\cern.ch\dfs\Applications\Altium\Datasheets\R0603_NIC_NRC.pdf; Author: CERN DEM JLC; CreateDate: 03.12.2007; LatestRevisionDate: 13.03.2008
R257 R263 R266 R329 = R0402_100K_1%_0.0625W_100PPM: Resistor - 1%; Part Description: General Purpose Thick Film Chip Resistor; Manufacturer: GENERIC; Manufacturer1 Part Number: 232270671004L; TC: ±100ppm/°C; PressFit: No; Part Number: R0402_100K_1%_0.0625W_100PPM; Component Kind: Standard; Component Type: Standard; Pin Count: 2; Value: 100k; Status: Not Recommended; Power: 0.0625W; Tolerance: ±1%; Manufacturer Part Number: R0402_100K_1%_0.0625W_100PPM; Case: 0402; Mounted: Yes; Sense: No; Socket: No; SMD: Yes; Manufacturer1 Example: YAGEO PHYCOMP; Manufacturer1 ComponentHeight: 0.4mm; HelpURL: \\cern.ch\dfs\Applications\Altium\Datasheets\R0402_Phycomp_RC0402.pdf; Author: CERN DEM JLC; CreateDate: 03.12.2007; LatestRevisionDate: 17.10.2012
R322#1 R323#1 R324 R325 = R0402_10K_1%_0.0625W_100PPM: Resistor - 1%; Part Description: General Purpose Thick Film Chip Resistor; Manufacturer: GENERIC; Manufacturer1 Part Number: 232270671003L; TC: ±100ppm/°C; PressFit: No; Part Number: R0402_10K_1%_0.0625W_100PPM; Component Kind: Standard; Component Type: Standard; Pin Count: 2; Value: 10k; Status: Not Recommended; Power: 0.0625W; Tolerance: ±1%; Manufacturer Part Number: R0402_10K_1%_0.0625W_100PPM; Case: 0402; Mounted: Yes; Sense: No; Socket: No; SMD: Yes; Manufacturer1 Example: YAGEO PHYCOMP; Manufacturer1 ComponentHeight: 0.4mm; HelpURL: \\cern.ch\dfs\Applications\Altium\Datasheets\R0402_Phycomp_RC0402.pdf; Author: CERN DEM JLC; CreateDate: 03.12.2007; LatestRevisionDate: 17.10.2012
R327 = RES_1206: SMD Resistor; Supplier 1: Newark; Supplier Part Number 1: 39K0871
T14 T15 T29 T41 = BSS138LT1G: N-CHANNEL MOSFET WITH DIODE; Part Description: 50V 200mA N-Channel Enhancement Mode Field-Effect Transistor; Manufacturer: ON SEMICONDUCTOR; PressFit: No; Bonding: No; Part Number: BSS138LT1G; Component Kind: Standard; Component Type: Standard; Device: BSS138LT1G; PackageDescription: SOT23 3-Leads, Pitch 0.95mm - Body 1.4x3mm, IPC Medium Density; Manufacturer Part Number: BSS138LT1G; Pin Count: 3; Case: SOT23-3; Mounted: Yes; Socket: No; SMD: Yes; Sense: No; ComponentHeight: 1.11mm; HelpURL: \\cern.ch\dfs\Applications\Altium\Datasheets\BSS138LT1G.pdf; Author: CERN DEM JLC; CreateDate: 23.03.2009; LatestRevisionDate: 23.03.2009
TP23 TP24 = SMD_PAD_1.27X1.27MM: Part Description: 1.27mm x 1.27mm PCB Copper Area (SMD Test Point); Mounted: No; Part Number: SMD_PAD_1.27X1.27MM; Component Kind: Standard (No BOM); Component Type: Standard (No BOM); Pin Count: 1; Family: Test Point; Socket: No; SMD: Yes; Sense: No; Status: None; ComponentHeight: 0mm; HelpURL: Undefined; Author: CERN DEM JLC; CreateDate: 12.01.2008; LatestRevisionDate: 12.01.2008; PackageDescription: 1.27mm x 1.27mm PCB Copper Area (SMD Test Point)
X3 = X_CRYSTAL_HC49_SMT: Crystal oscillator; Supplier 1: Newark; Supplier Part Number 1: 56P2843